# EAGLE design BSPD_TNN_V1.0 (EAGLE 9.6.2)
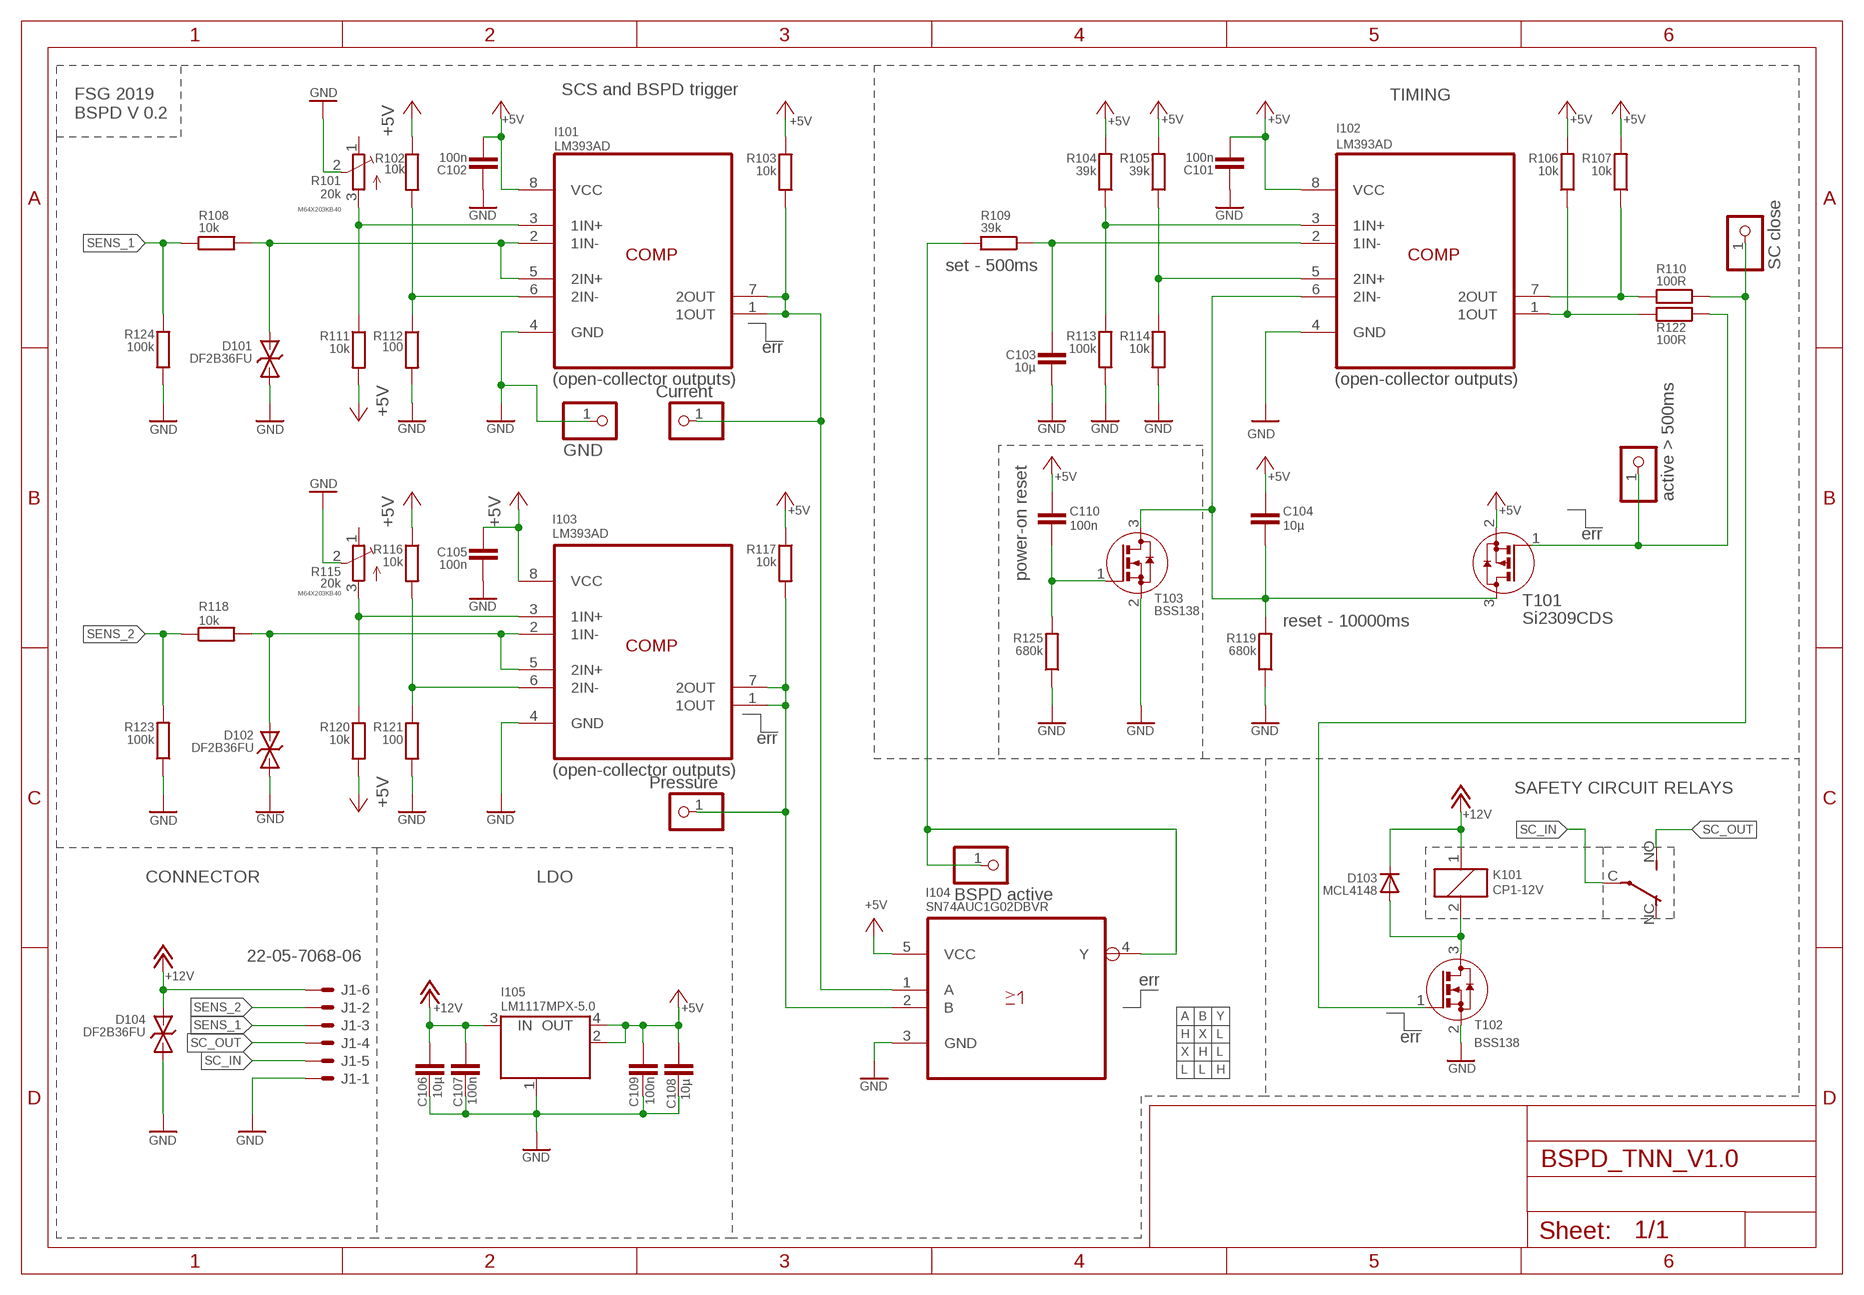
[diagram p0: schematic, sheet 1]

## Parts
C101  100n  C-EUC0603  [C0603]
C102  100n  C-EUC0603  [C0603]
C103  10µ  C-EUC1206  [C1206]
C104  10µ  C-EUC1206K  [C1206K]
C105  100n  C-EUC0603  [C0603]
C106  10µ  C-EUC1206  [C1206]
C107  100n  C-EUC0603  [C0603]
C108  10µ  C-EUC1206  [C1206]
C109  100n  C-EUC0603  [C0603]
C110  100n  C-EUC0603  [C0603]
D101  DF2B36FU  [SOD323]
D102  DF2B36FU  [SOD323]
D103  MCL4148  D.MCL4148  [MICROMELF]
D104  DF2B36FU  [SOD323]
I101  LM393AD  [SOIC127P600X175-8N]
I102  LM393AD  [SOIC127P600X175-8N]
I103  LM393AD  [SOIC127P600X175-8N]
I104  SN74AUC1G02DBVR  NC7SZ08M5X  [SOT95P280X145-5N]
I105  LM1117MPX-5.0  0022_LM1117IMPX-5.0  [LINEAR_SOT223]
J1  22-05-7068-06  [7395-06]
JP1  Pressure  PINHD-1X1  [1X01]
JP2  Current  PINHD-1X1  [1X01]
JP3  BSPD active  PINHD-1X1  [1X01]
JP4  active > 500ms  PINHD-1X1  [1X01]
JP5  SC close  PINHD-1X1  [1X01]
JP6  GND  PINHD-1X1  [1X01]
K101  CP1-12V  [CP1]
R101  20k  POTI.M64X201KB40  [M64X201KB40]
R102  10k  R-EU_R0603  [R0603]
R103  10k  R-EU_R0603  [R0603]
R104  39k  R-EU_R0603  [R0603]
R105  39k  R-EU_R0603  [R0603]
R106  10k  R-EU_R0603  [R0603]
R107  10k  R-EU_R0603  [R0603]
R108  10k  R-EU_R0603  [R0603]
R109  39k  R-EU_R0603  [R0603]
R110  100R  R-EU_R0603  [R0603]
R111  10k  R-EU_R0603  [R0603]
R112  100  R-EU_R0603  [R0603]
R113  100k  R-EU_R0603  [R0603]
R114  10k  R-EU_R0603  [R0603]
R115  20k  POTI.M64X201KB40  [M64X201KB40]
R116  10k  R-EU_R0603  [R0603]
R117  10k  R-EU_R0603  [R0603]
R118  10k  R-EU_R0603  [R0603]
R119  680k  R-EU_R0603  [R0603]
R120  10k  R-EU_R0603  [R0603]
R121  100  R-EU_R0603  [R0603]
R122  100R  R-EU_R0603  [R0603]
R123  100k  R-EU_R0603  [R0603]
R124  100k  R-EU_R0603  [R0603]
R125  680k  R-EU_R0603  [R0603]
T101  Si2309CDS  P-MOSFET.SOT23  [SOT-23]
T102  BSS138  N-MOSFET.SOT23  [SOT-23]
T103  BSS138  N-MOSFET.SOT23  [SOT-23]

## Nets
+5V: C101.2 C102.2 C104.1 C105.2 C108.1 C109.2 C110.1 I101.8(VCC) I102.8(VCC) I103.8(VCC) I104.5(VCC) I105.2(OUT) I105.4(OUT) R102.1 R103.1 R104.2 R105.2 R106.2 R107.2 R111.2 R116.1 R117.1 R120.2 T101.2(S)
+12V: C106.1 C107.1 D103.C D104.2(C) I105.3(IN) J1.6 K101.1
BRAKE_F: D101.2(C) I101.2(1IN-) I101.5(2IN+) R108.2
DF: D102.2(C) I103.2(1IN-) I103.5(2IN+) R118.2
GND: C101.1 C102.1 C103.2 C105.1 C106.2 C107.2 C108.2 C109.1 D101.1(A) D102.1(A) D104.1(A) I101.4(GND) I102.4(GND) I103.4(GND) I104.3(GND) I105.1(GND/ADJ) J1.1 JP6.1 R101.2(M) R112.2 R113.1 R114.1 R115.2(M) R119.1 R121.2 R123.1 R124.1 R125.1 T102.2(S) T103.2(S)
N$1: I102.5(2IN+) R105.1 R114.2
N$2: I103.1(1OUT) I103.7(2OUT) I104.2(B) JP1.1 R117.2
N$3: I101.1(1OUT) I101.7(2OUT) I104.1(A) JP2.1 R103.2
N$4: I102.1(1OUT) R106.1 R122.2
N$5: C110.2 R125.2 T103.1(G)
N$6: I101.3(1IN+) R101.3(A) R111.1
N$7: C104.2 I102.6(2IN-) R119.2 T101.3(D) T103.3(D)
N$8: I103.3(1IN+) R115.3(A) R120.1
N$10: JP5.1 R110.1 T102.1(G)
N$11: D103.A K101.2 T102.3(D)
N$12: C103.1 I102.2(1IN-) R109.1
N$13: I102.3(1IN+) R104.1 R113.2
N$14: I101.6(2IN-) R102.2 R112.1
N$15: I102.7(2OUT) R107.1 R110.2
N$16: I103.6(2IN-) R116.2 R121.1
N$20: JP4.1 R122.1 T101.1(G)
N$66: I104.4(Y) JP3.1 R109.2
SC_IN: J1.5 K101.C(2:P)
SC_OUT: J1.4 K101.NO(2:S)
SENS_1: J1.3 R108.1 R124.2
SENS_2: J1.2 R118.1 R123.2
Unconnected: K101.NC(2:O) R101.1(E) R115.1(E)

## Notes on the sheet
- SCS and BSPD trigger
- TIMING
- FSG 2019
  BSPD V 0.2
- M64X203KB40
- COMP | COMP
- set - 500ms
- err
- (open-collector outputs) | (open-collector outputs)
- err
- power-on reset
- M64X203KB40
- reset - 10000ms
- COMP
- err
- (open-collector outputs)
- SAFETY CIRCUIT RELAYS
- CONNECTOR | LDO
- err
- A | B | Y
- H | X | L
- err
- X | H | L
- L | L | H

## Library data of the parts
C101 C102 C105 = resistor:C-EU: CAPACITOR, European symbol
C103 C104 C106-C110 = rcl:C-EU: CAPACITOR, European symbol
D101 D102 D104 = diode:DF2B36FU
D103 = MCS-Dioden:D; HEIGHT: 1.2
I101-I103 = TI-LM393AD:LM393AD: DUAL DIFFERENTIAL COMPARATORS,SOIC-8; MPN: LM393AD; OC_FARNELL: 4586128; OC_NEWARK: 91F3640; PACKAGE: SOIC- 8; SUPPLIER: TEXAS INSTRUMENTS
I104 = Arduino:NC7SZ08M5X: Tiny logic UHS Two Input AND Gate; MPN: NC7SZ08M5X; OC_FARNELL: 1613980; OC_NEWARK: 58K1975; PACKAGE: SOT-23-5; SUPPLIER: Fairchild
I105 = IntegratedCircuits:0022_LM1117IMPX-5.0: Low-dropout linear regulator 5V -LM1117IMPX-5.0; CASE: SOT223; MONTHLY_USAGE: _____; PART_NUMBER: LM1117IMPX-5.0; PRICE: _____; SUPPLIER: _____; TYPE: Circuito_Integrato; VALUE: LM1117IMPX-5.0
J1 = con-molex:22-?-06: CONNECTOR wire to board 2.54 mm (.1 inch) pitch header; MF: MOLEX; OC_FARNELL: unknown; OC_NEWARK: unknown
JP1-JP6 = pinhead:PINHD-1X1: PIN HEADER
K101 = relay:CP1?-*: ULTRA-MINIATURE LOW PROFILE AUTOMOTIVE RELAY NAiS Source: http://www.mew-europe.com/.. en_ds_61207_0000.pdf; MF: AROMAT/ MATSUSHITA; MPN: CP1-12V; OC_FARNELL: unknown; OC_NEWARK: 10C5508
R101 R115 = MCS-rcl:POTI
R102-R114 R116-R125 = resistor:R-EU_: RESISTOR, European symbol
T101 = MCS-Transistoren:P-MOSFET; HEIGHT: 1.2
T102 T103 = MCS-Transistoren:N-MOSFET; HEIGHT: 1.2

## Board
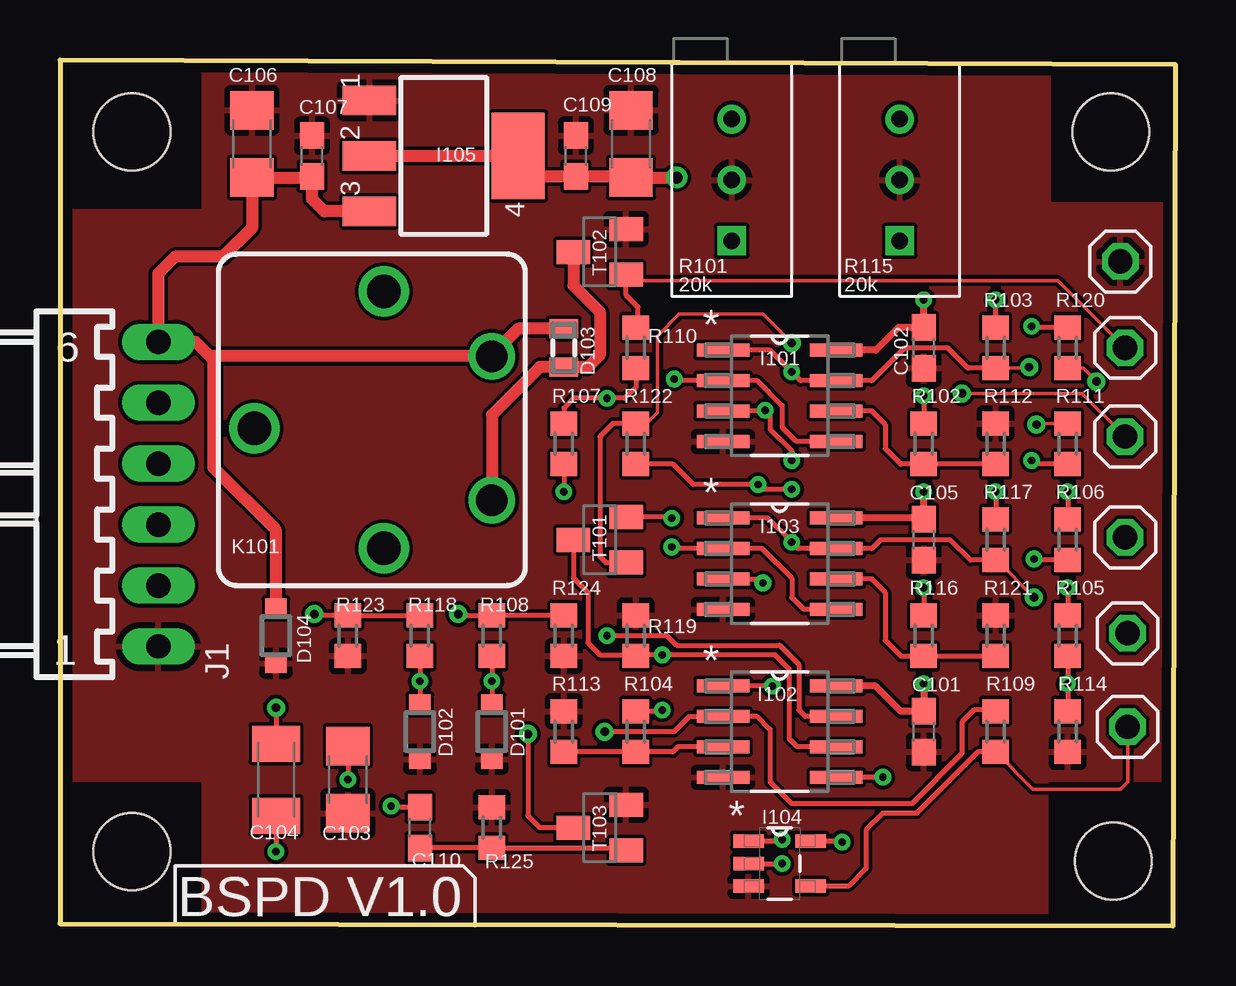
[diagram p1: board, top side]
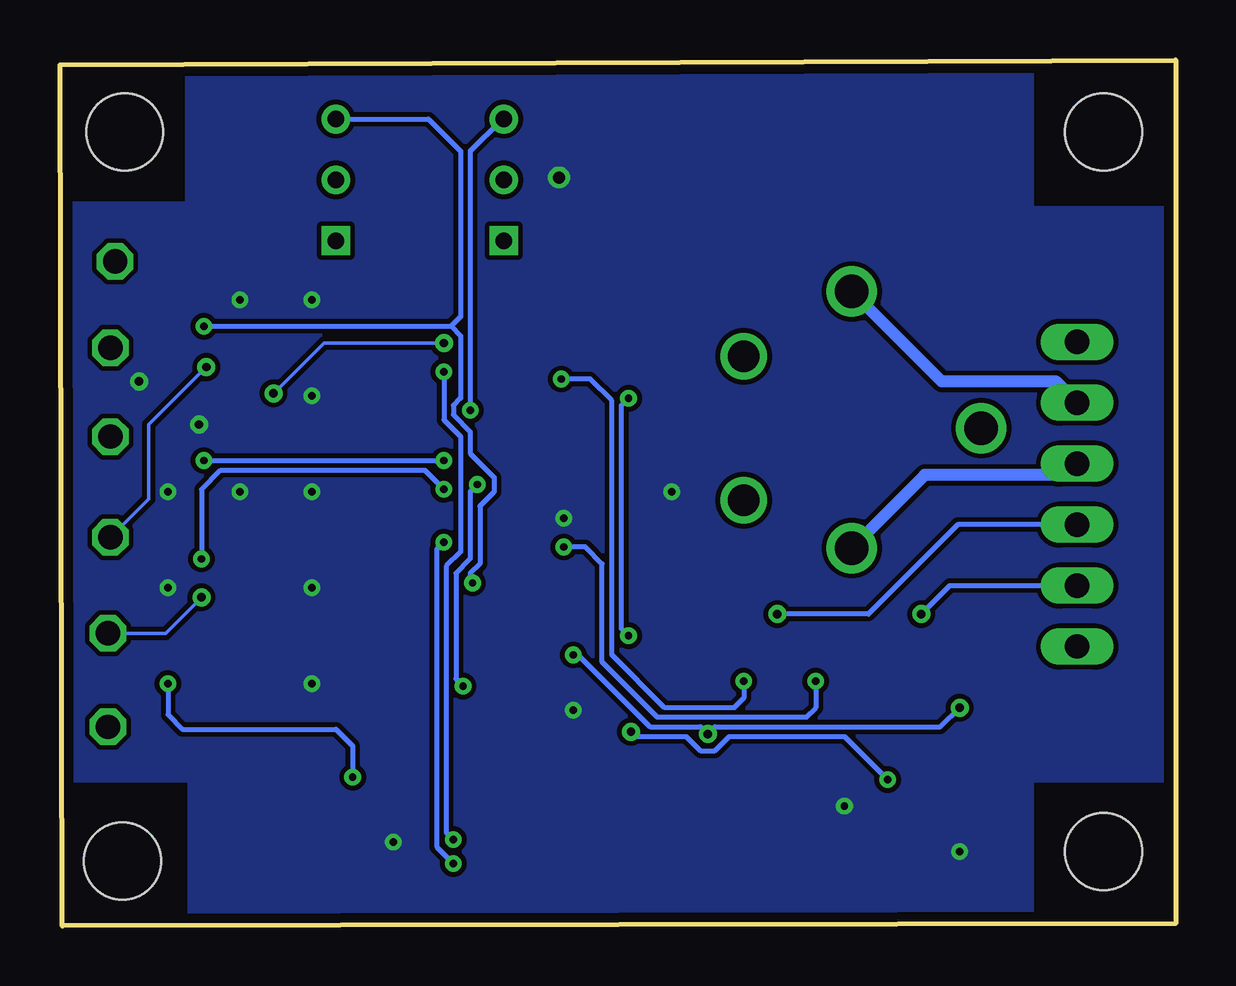
[diagram p2: board, bottom side, seen from below]

Size 46.5 x 36.1 mm. Coordinates in mm from the lower left corner, seen from the top.
Outline: 0,0.1 46.4,0 46.5,35.9 0,36.1 0,0.1
Copper layers (1*16): Top 0.035mm / dielectric 0.11mm / Bottom 0.035mm
Design rules "MCS-standard *": minimum track width 0.15mm, minimum drill 0.3mm, track to track 0.15mm, track to pad 0.15mm, pad to pad 0.15mm, via to via 0.15mm, smd to smd 0.15mm, copper to edge 0.4mm, drill to drill 0.3mm, minimum pad ring 10mil, minimum via ring 0.2mm, stop-mask expansion 0.05mm, vias tented up to drill 0.4mm, thermal gap 10mil
Holes 3.2 mm at 3,33.1 3,3.1 43.9,2.7 43.8,33.1
tKeepout: area 38.2,30.3 to 43.8,35.9; area 0.2,30.3 to 5.8,35.9; area 0.2,0.3 to 5.8,5.9; area 38.2,0.3 to 43.8,5.9

### Footprints (pad centres in the part's own frame; a part is rotated, then mirrored left to right if it is on the bottom)
C0603 = smd 1.1 x 1: 1 -0.85,0; 2 0.85,0
C1206 = smd 1.6 x 1.8: 1 -1.4,0; 2 1.4,0
C1206K = smd 1.5 x 2: 1 -1.5,0; 2 1.5,0
SOD323 = smd 0.8 x 0.9: 1 -1.15,0; 2 1.15,0
MICROMELF = smd 0.8 x 1.2: A -0.8,0; C 0.8,0
SOIC127P600X175-8N = smd 2.184 x 0.559: 1 -2.362,1.905; 2 -2.362,0.635; 3 -2.362,-0.635; 4 -2.362,-1.905; 5 2.362,-1.905; 6 2.362,-0.635; 7 2.362,0.635; 8 2.362,1.905
SOT95P280X145-5N = smd 1.27 x 0.559: 1 -1.295,0.94; 2 -1.295,0; 3 -1.295,-0.94; 4 1.295,-0.94; 5 1.295,0.94
LINEAR_SOT223 = smd 1.219 x 2.235: 1 -2.311,-3.099; 2 0,-3.099; 3 2.311,-3.099 | smd 3.6 x 2.2: 4 0,3.099
7395-06 = drill 1.016 long: 1 6.35,0; 2 3.81,0; 3 1.27,0; 4 -1.27,0; 5 -3.81,0; 6 -6.35,0
1X01 = drill 1.016 octagon: 1 0,0
CP1 = drill 1.3: 1 2.65,-4.5; 2 -3.35,-4.5 | drill 1.4: C 5.35,0; NC -0.35,5.4; NO -5.35,0
M64X201KB40 = drill 0.7 square: 1 -2.54,0 | drill 0.7: 2 0,0; 3 2.54,0
R0603 = smd 1 x 1.1: 1 -0.85,0; 2 0.85,0
SOT-23 = smd 1 x 1.4: 1 -0.95,-1.1; 2 0.95,-1.1; 3 0,1.1

### Placement (x,y rotation side)
C101  36,8.1 90 top
C102  36,24.1 90 top
C103  12,6.1 270 top
C104  9,6.1 90 top
C105  36,16.1 90 top
C106  8,32.6 90 top
C107  10.5,32.1 90 top
C108  23.8,32.6 90 top
C109  21.5,32.1 270 top
C110  15,4.1 270 top
D101  18,8.1 90 top
D102  15,8.1 90 top
D103  21,24.1 90 top
D104  9,12.1 90 top
I101  30,22.1 0 top
I102  30,8.1 0 top
I103  30,15.1 0 top
I104  30,2.6 0 top
I105  16,32.1 270 top
J1  4.1,18 270 top
JP1  44.5,12.2 0 top
JP2  44.4,16.2 0 top
JP3  44.5,8.3 0 top
JP4  44.4,20.4 0 top
JP5  44.4,24.1 0 top
JP6  44.2,27.7 0 top
K101  13.5,21.1 90 top
R101  28,31.1 90 top
R102  36,20.1 270 top
R103  39,24.1 270 top
R104  24,8.1 90 top
R105  42,12.1 90 top
R106  42,16.1 90 top
R107  21,20.1 270 top
R108  18,12.1 270 top
R109  39,8.1 270 top
R110  24,24.1 270 top
R111  42,20.1 90 top
R112  39,20.1 90 top
R113  21,8.1 270 top
R114  42,8.1 90 top
R115  35,31.1 90 top
R116  36,12.1 270 top
R117  39,16.1 270 top
R118  15,12.1 270 top
R119  24,12.1 270 top
R120  42,24.1 270 top
R121  39,12.1 90 top
R122  24,20.1 270 top
R123  12,12.1 90 top
R124  21,12.1 90 top
R125  18,4.1 270 top
T101  22.5,16.1 90 top
T102  22.5,28.1 90 top
T103  22.5,4.1 90 top

### Tracks (layer width: path | path; a pad name or v marks a point on that pad's centre or on a via)
+5V  (via drill 0.3, 0.35, 0.5)
  Top 0.152: R111.2 40.75,20.95 v40.7,20.9 | R120.2 42.65,23.25 v43.2,22.7
  Top 0.2: v36,14.1 R116.1 | v36,22.1 R102.1 | R107.2 v21,18.1 | T101.2 25.45,17.05 v25.5,17 | R104.2 25.05,8.95 v25.1,9 | v42,14.1 R105.2 | v42,18.1 R106.2 | C110.1 13.85,4.95 v13.8,5 | C104.1 v9,3.1 | I104.5 32.56,3.54 v32.6,3.5 | v39,18.1 R117.1 | R103.1 v39,26.1
  Top 0.3: I101.8 34.01,24.01 34.95,24.95 C102.2 v36,26.1 | I103.8 35.95,17.01 C105.2 v36,18.1 | I102.8 33.99,10 35.05,8.95 C101.2 v36,10.1
  Top 0.5: I105.2 I105.4 19.95,31.25 C109.2 23.75,31.25 C108.1 v25.7,31.2
  pour Bottom (isolate 0.2): 6,36.1 41.2,36.1 41.2,30.1 46.5,30.1 46.5,6.1 41.1,6.1 41.1,0.1 6,0.1 6,6.1 -0.6,6.1 -0.6,29.9 6,29.9
+12V
  Top 0.5: K101.1 18,23.8 19.1,24.9 D103.C | I105.3 11.01,29.79 10.5,30.3 C107.1 10.45,31.2 C106.1 8,29.1 6.8,27.9 4.8,27.9 4.1,27.2 | D104.2 9,16.5 6.4,19.1
  Top 0.508: 4.1,27.2 J1.6 5.65,24.35 6.15,23.85 6.25,23.75 | 6.4,19.1 6.4,23.6 6.25,23.75 | K101.1 6.25,23.75
BRAKE_F  (via drill 0.3)
  Top 0.2: v25.6,22.8 25.66,22.74 I101.2 29.07,22.74 30.1,21.7 30.1,20.8 30.7,20.2 I101.5 | D101.2 v18,10.2 R108.2
  Bottom 0.2: v25.6,22.8 24.4,22.8 23.5,21.9 23.5,11.3 21.3,9.1 18.4,9.1 18,9.5 v18,10.2
DF  (via drill 0.3)
  Top 0.2: v25.5,15.8 25.57,15.73 I103.2 29.27,15.73 30.5,14.5 30.5,13.7 31,13.2 I103.5 | R118.2 v15,10.2 D102.2
  Bottom 0.2: v15,10.2 15,9.1 15.4,8.7 21.6,8.7 23.9,11 23.9,15.1 24.6,15.8 v25.5,15.8
GND
  pour Top: 0,29.8 6,29.8 6,36.1 41.2,36.1 41.2,30.1 46.5,30.1 46.5,6.1 41.1,6.1 41.1,0.1 6,0.1 6,6.1 0,6.1
N$1  (via drill 0.3)
  Top 0.2: R114.2 v42,10.1 R105.1 | I102.5 v34.3,6.19 v34.3,6.2
  Bottom 0.2: v42,10.1 42,8.8 41.4,8.2 35,8.2 34.3,7.5 v34.3,6.2
N$2  (via drill 0.3, 0.35)
  Top 0.152: v40.6,13.7 39.05,15.25 R117.2
  Top 0.2: I103.1 29.5,17.01 v30.5,16 30.77,15.73 I103.7 33.84,15.73 34.2,16.1 37.1,16.1 37.95,15.25 R117.2 | I104.2 v30.1,2.6
  Bottom 0.152: JP1.1 42.1,12.2 v40.6,13.7
  Bottom 0.2: v30.5,16 30.8,15.7 30.8,3.3 v30.1,2.6
N$3  (via drill 0.3, 0.35)
  Top 0.152: v40.4,23.3 40.35,23.25 R103.2
  Top 0.2: I101.1 29.59,24.01 v30.5,23.1 30.86,22.74 I101.7 33.84,22.74 35.2,24.1 37,24.1 37.85,23.25 R103.2 | I104.1 30.04,3.54 v30.1,3.6
  Bottom 0.152: JP2.1 42.8,17.8 42.8,20.9 v40.4,23.3
  Bottom 0.2: v30.5,23.1 30.5,21.1 29.8,20.4 29.8,15.6 30.4,15 30.4,3.9 v30.1,3.6
N$4  (via drill 0.3)
  Top 0.2: R122.2 25.55,19.25 26.4,18.4 v29.1,18.4 29.3,18.2 v30.5,18.2 | v29.7,10 I102.1 | R106.1 40.65,15.25 v40.6,15.3
  Bottom 0.2: v29.1,18.4 29.4,18.1 29.4,15.3 30,14.7 30,10.3 v29.7,10 | v40.6,15.3 40.6,18.2 39.8,19 31.3,19 v30.5,18.2
N$5
  Top 0.2: C110.2 R125.2 23.5,3.25 T103.1
N$6  (via drill 0.3)
  Top 0.2: I101.3 29.36,21.46 v29.4,21.5 29.6,21.3 29.6,20.7 30.5,19.8 v30.5,19.4 | R111.1 40.65,19.25 v40.5,19.4
  Bottom 0.2: v29.4,21.5 29.4,32.3 28.06,33.64 R101.3 | v40.5,19.4 v30.5,19.4
N$7  (via drill 0.3, 0.35)
  Top 0.2: v9,9.1 C104.2 | T101.3 21.4,14.5 22,13.9 22,11.8 22.5,11.3 24.05,11.3 | T103.3 20,4.1 19.5,4.6 v19.5,8 | I102.6 30.73,7.46 30.4,7.8 30.4,10.7 29.8,11.3 v25.1,11.3 24.05,11.3 | 24.05,11.3 R119.2
  Bottom 0.2: v9,9.1 9.8,8.3 19.2,8.3 v19.5,8 19.8,8.3 21.9,8.3 24.9,11.3 v25.1,11.3
N$8  (via drill 0.3)
  Top 0.2: v29.3,14.3 29.14,14.46 I103.3 | R120.1 40.55,24.95 v40.5,25
  Bottom 0.2: R115.3 31.14,33.64 29.8,32.3 29.8,25.4 30.2,25 | 30.2,25 29.8,24.6 29.8,22 30.1,21.7 30.1,21.3 29.4,20.6 29.4,19.7 28.4,18.7 28.4,18.1 29,17.5 29,15.1 29.4,14.7 29.4,14.4 v29.3,14.3 | v40.5,25 30.2,25
N$10
  Top 0.152: JP5.1 41.6,26.9 23.85,26.9 T102.1
  Top 0.2: R110.1 24.1,25.05 24.1,25.8 23.6,26.3 23.6,27 T102.1
N$11
  Top 0.5: T102.3 21.4,26.7 22.5,25.6 22.5,23.8 22,23.3 D103.A 20,23.3 18,21.3 K101.2
N$12  (via drill 0.3, 0.35)
  Top 0.2: R109.1 38.95,9 38.1,9 37.6,8.5 37.6,7.2 35.5,5.1 30.5,5.1 29.6,6 29.6,8.2 29.07,8.73 I102.2 26.23,8.73 25.6,8.1 v22.7,8.1 | C103.1 v12,6.1
  Bottom 0.2: v12,6.1 13.8,7.9 18.6,7.9 19.2,7.3 19.8,7.3 20.4,7.9 22.5,7.9 v22.7,8.1
N$13
  Top 0.2: I102.3 25.77,7.46 25.55,7.25 R104.1 R113.2
N$14
  Top 0.2: R112.1 R102.2 35.05,19.25 34.4,19.9 34.4,20.9 33.84,21.46 I101.6
N$15  (via drill 0.3)
  Top 0.2: R107.1 21,21.6 21.4,22 v22.8,22 23.55,22 24,22.45 R110.2 | I102.7 31.07,8.73 30.8,9 30.8,10.9 30,11.7 25.7,11.7 25.3,12.1 v22.8,12.1
  Bottom 0.2: v22.8,12.1 23.1,12.4 23.1,21.7 v22.8,22
N$16
  Top 0.2: I103.6 33.84,14.46 34.4,13.9 34.4,11.9 35.05,11.25 R116.2 R121.1
N$20  (via drill 0.35)
  Top 0.152: JP4.1 42.6,22.2 v37.6,22.2 | v30.5,24.3 29.3,25.5 25.8,25.5 24.9,24.6 24.9,21.4 24.45,20.95 R122.1
  Top 0.2: R122.1 23.05,20.95 22.5,20.4 22.5,15.4 22.75,15.15 T101.1
  Bottom 0.152: v37.6,22.2 35.5,24.3 v30.5,24.3
N$66
  Top 0.152: JP3.1 44.5,6 44.2,5.7 40.55,5.7 R109.2
  Top 0.2: R109.2 38.25,7.25 35.7,4.7 34.3,4.7 33.6,4 33.6,2.4 32.86,1.66 I104.4
SC_IN
  Bottom 0.5: K101.C 9.75,22.7 4.99,22.7
  Bottom 0.508: J1.5 4.99,22.7
SC_OUT
  Bottom 0.5: K101.NO 10.45,18.8 4.57,18.8
  Bottom 0.508: J1.4 4.57,18.8
SENS_1  (via drill 0.35)
  Top 0.2: R124.2 R108.1 16.65,12.95 v16.6,13
  Bottom 0.2: v16.6,13 12.8,13 9.07,16.73 J1.3
SENS_2  (via drill 0.35)
  Top 0.2: R118.1 R123.2 10.65,12.95 v10.6,13
  Bottom 0.2: v10.6,13 9.41,14.19 J1.2

### Text on the board
tNames: BSPD V1.0
tStop: S1 | S2 | FSG 2019 BSPD V0.2